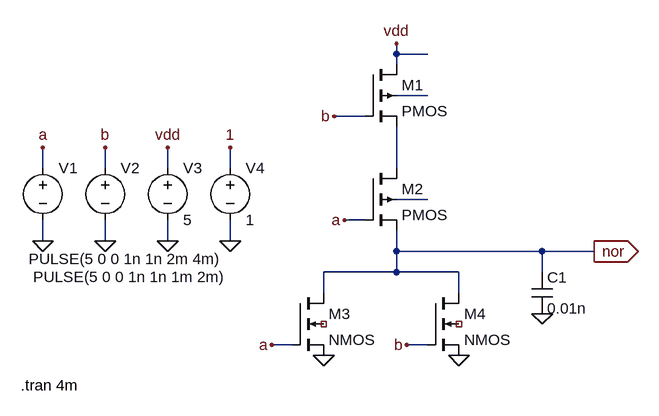
[diagram p0: schematic nor_gate.asc]
nor_gate.asc, the LTspice schematic file:
Version 4
SHEET 1 880 680
WIRE 416 -80 416 -96
WIRE 464 -80 416 -80
WIRE 416 -64 416 -80
WIRE 464 -16 416 -16
WIRE 368 16 320 16
WIRE -128 96 -128 64
WIRE -32 96 -32 64
WIRE 64 96 64 64
WIRE 160 96 160 64
WIRE 416 96 416 32
WIRE 464 144 416 144
WIRE 368 176 336 176
WIRE -128 208 -128 176
WIRE -32 208 -32 176
WIRE 64 208 64 176
WIRE 160 208 160 176
WIRE 416 224 416 192
WIRE 640 224 416 224
WIRE 720 224 640 224
WIRE 416 256 416 224
WIRE 416 256 304 256
WIRE 512 256 416 256
WIRE 640 256 640 224
WIRE 304 288 304 256
WIRE 512 288 512 256
WIRE 256 368 224 368
WIRE 464 368 432 368
FLAG -128 64 a
FLAG -32 64 b
FLAG 64 64 vdd
FLAG 160 64 1
FLAG 160 208 0
FLAG 64 208 0
FLAG -32 208 0
FLAG -128 208 0
FLAG 416 -96 vdd
FLAG 320 16 b
FLAG 336 176 a
FLAG 720 224 nor
IOPIN 720 224 Out
FLAG 432 368 b
FLAG 224 368 a
FLAG 512 384 0
FLAG 304 384 0
FLAG 640 320 0
SYMBOL voltage -128 80 R0
WINDOW 3 -22 156 Left 2
WINDOW 123 0 0 Left 0
WINDOW 39 0 0 Left 0
SYMATTR InstName V1
SYMATTR Value PULSE(5 0 0 1n 1n 2m 4m)
SYMBOL voltage -32 80 R0
WINDOW 3 -111 183 Left 2
WINDOW 123 0 0 Left 0
WINDOW 39 0 0 Left 0
SYMATTR InstName V2
SYMATTR Value PULSE(5 0 0 1n 1n 1m 2m)
SYMBOL voltage 64 80 R0
WINDOW 123 0 0 Left 0
WINDOW 39 0 0 Left 0
SYMATTR InstName V3
SYMATTR Value 5
SYMBOL voltage 160 80 R0
WINDOW 123 0 0 Left 0
WINDOW 39 0 0 Left 0
SYMATTR InstName V4
SYMATTR Value 1
SYMBOL pmos4 368 -64 R0
SYMATTR InstName M1
SYMBOL pmos4 368 96 R0
SYMATTR InstName M2
SYMBOL nmos4 256 288 R0
SYMATTR InstName M3
SYMBOL nmos4 464 288 R0
SYMATTR InstName M4
SYMBOL cap 624 256 R0
SYMATTR InstName C1
SYMATTR Value 0.01n
TEXT -162 430 Left 2 !.tran 4m

The netlist it stands for:
* nor_gate.asc
V1 a 0 PULSE(5 0 0 1n 1n 2m 4m)
V2 b 0 PULSE(5 0 0 1n 1n 1m 2m)
V3 vdd 0 5
V4 1 0 1
M1 vdd b N002 N001 PMOS
M2 N002 a nor N003 PMOS
M3 nor a 0 NC_01 NMOS
M4 nor b 0 NC_02 NMOS
C1 nor 0 0.01n
.model NMOS NMOS
.model PMOS PMOS
.lib standard.mos
.tran 4m
.backanno
.end